# Altium schematic sheet Codec.SchDoc
size A0
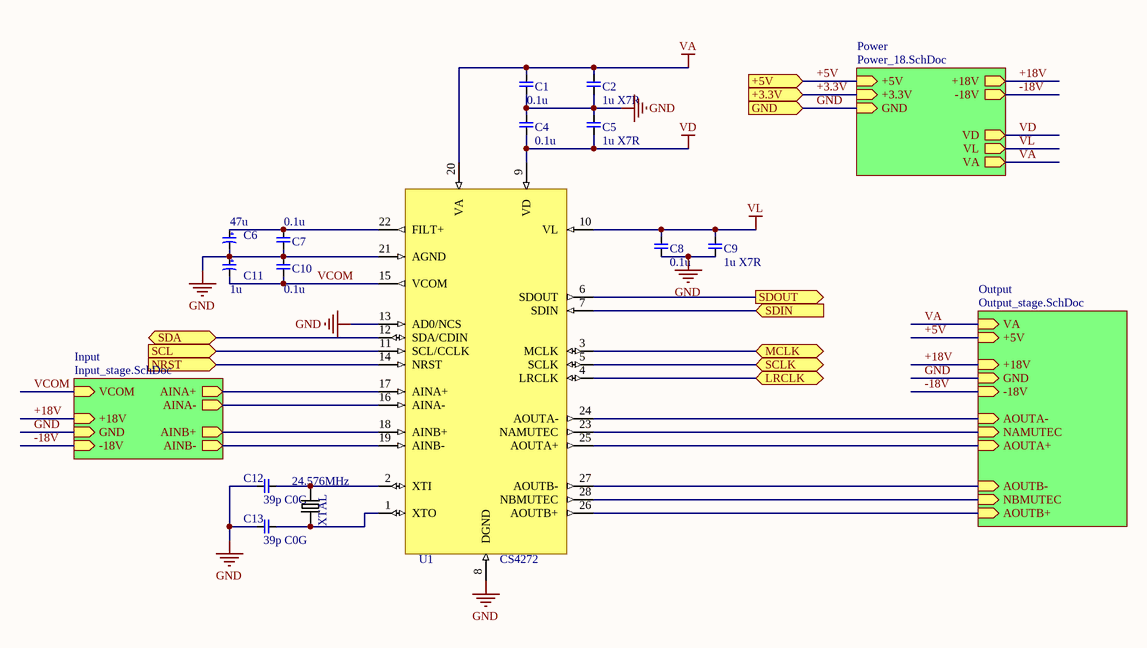
[diagram p0: Codec.SchDoc]

## Parts
24.576MHz  XTAL  [XTAL_hc-49_smd]
C1  0.1u  [0805_cap]
C2  1u X7R  [0805_cap]
C4  0.1u  [0805_cap]
C5  1u X7R  [0805_cap]
C6  47u  [cap 4x5.4]
C7  0.1u  [0805_cap]
C8  0.1u  [0805_cap]
C9  1u X7R  [0805_cap]
C10  0.1u  [0805_cap]
C11  1u  [cap 4x5.4]
C12  39p C0G  [0805_cap]
C13  39p C0G  [0805_cap]
U1  CS4272  [TSSOP-28]

## Sub-sheets
Input = Input_stage.SchDoc: AINA+ (out), AINB+ (out), +18V (in), GND (in), VCOM (in), AINB- (out), AINA- (out), -18V (in)
Output = Output_stage.SchDoc: NAMUTEC (in), AOUTA+ (in), -18V (in), GND (in), +5V (in), NBMUTEC (in), AOUTA- (in), VA (in), AOUTB- (in), +18V (in), AOUTB+ (in)
Power = Power_18.SchDoc: +3.3V (in), GND (in), -18V (out), +18V (out), VD (out), VL (out), VA (out), +5V (in)

## Ports
+3.3V (in), +5V (in), GND (in), LRCLK (bidir), MCLK (bidir), NRST (in), SCL (in), SCLK (bidir), SDA (bidir), SDIN (in), SDOUT (out)

## Nets
GND: C1.1 C2.1 C4.2 C5.2 C6.2 C7.1 C8.1 C9.1 C10.2 C11.1 C12.1 C13.1 U1.8(DGND) U1.13(AD0/NCS) U1.21(AGND) ; port GND, sheet Input/GND, sheet Output/GND, sheet Power/GND
VA: C1.2 C2.2 U1.20(VA) ; sheet Output/VA, sheet Power/VA
VD: C4.1 C5.1 U1.9(VD) ; sheet Power/VD
VL: C8.2 C9.2 U1.10(VL) ; sheet Power/VL
+3.3V: port +3.3V, sheet Power/+3.3V
+5V: port +5V, sheet Output/+5V, sheet Power/+5V
+18V: sheet Input/+18V, sheet Output/+18V, sheet Power/+18V
-18V: sheet Input/-18V, sheet Output/-18V, sheet Power/-18V
LRCLK: U1.4(LRCLK) ; port LRCLK
MCLK: U1.3(MCLK) ; port MCLK
NRST: U1.14(NRST) ; port NRST
SCL: U1.11(SCL/CCLK) ; port SCL
SCLK: U1.5(SCLK) ; port SCLK
SDA: U1.12(SDA/CDIN) ; port SDA
SDIN: U1.7(SDIN) ; port SDIN
SDOUT: U1.6(SDOUT) ; port SDOUT
VCOM: C10.1 C11.2 U1.15(VCOM) ; sheet Input/VCOM
Net24.576MHz_1: 24.576MHz.1 C13.2 U1.1(XTO)
Net24.576MHz_2: 24.576MHz.2 C12.2 U1.2(XTI)
NetC6_1: C6.1 C7.2 U1.22(FILT+)
NetU1_16: U1.16(AINA-) ; sheet Input/AINA-
NetU1_17: U1.17(AINA+) ; sheet Input/AINA+
NetU1_18: U1.18(AINB+) ; sheet Input/AINB+
NetU1_19: U1.19(AINB-) ; sheet Input/AINB-
NetU1_23: U1.23(NAMUTEC) ; sheet Output/NAMUTEC
NetU1_24: U1.24(AOUTA-) ; sheet Output/AOUTA-
NetU1_25: U1.25(AOUTA+) ; sheet Output/AOUTA+
NetU1_26: U1.26(AOUTB+) ; sheet Output/AOUTB+
NetU1_27: U1.27(AOUTB-) ; sheet Output/AOUTB-
NetU1_28: U1.28(NBMUTEC) ; sheet Output/NBMUTEC

## Library data of the parts
24.576MHz = hc-49_smd: Crystal 4MHz ?30ppm (Tol) ?50ppm (Stability) 20pF FUND 200Ohm 2-Pin HC-49/SDLF SMD T/R; MP: FOXSDLF/040; MF: Fox Electronics; Availability: Good; Price: 0.34 USD; Package: HC49SD Fox Electronics; SnapEDA_Link: https://www.snapeda.com/symbols-footprints/FOXSDLF/040/Fox%20Electronics/view-part/?ref=snap; Value: *
C1 C2 C4 C5 C7-C10 C12 C13 = Cap
C6 C11 = Cap_electrolytic